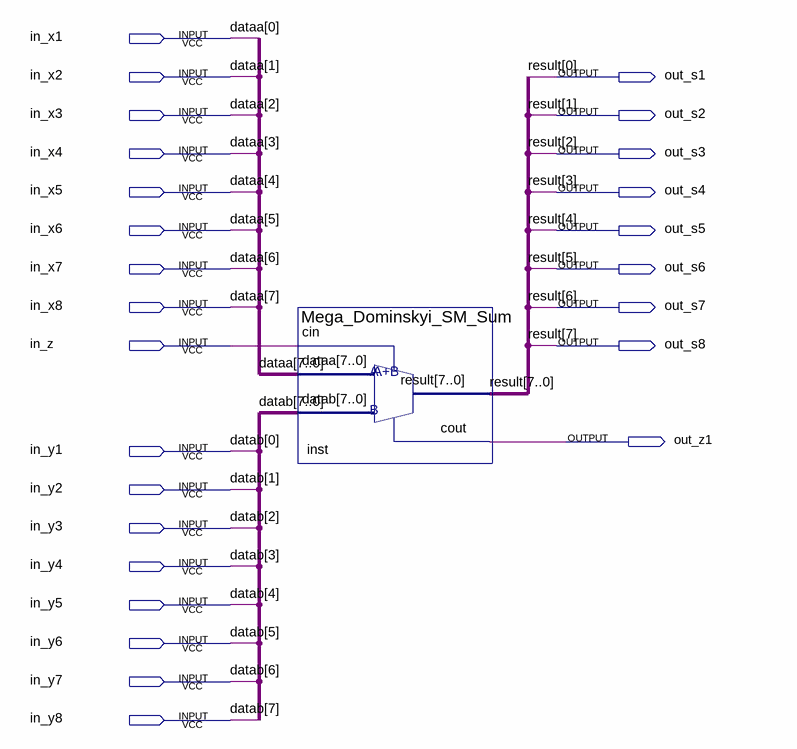
[diagram p0: schematic sheet]
// Quartus schematic Mega_Dominskyi_SM.bdf as structural Verilog: 1 symbols, 26 pins
module Mega_Dominskyi_SM (
  input  in_x1,
  input  in_x2,
  input  in_x3,
  input  in_x4,
  input  in_x5,
  input  in_x6,
  input  in_x7,
  input  in_x8,
  input  in_z,
  input  in_y1,
  input  in_y2,
  input  in_y3,
  input  in_y4,
  input  in_y5,
  input  in_y6,
  input  in_y7,
  input  in_y8,
  output out_s1,
  output out_s2,
  output out_s3,
  output out_s4,
  output out_s5,
  output out_s6,
  output out_s7,
  output out_s8,
  output out_z1
);

  Mega_Dominskyi_SM_Sum inst (
    .cin(in_z), .dataa({in_x8, in_x7, in_x6, in_x5, in_x4, in_x3, in_x2, in_x1}),
    .datab({in_y8, in_y7, in_y6, in_y5, in_y4, in_y3, in_y2, in_y1}),
    .result({out_s8, out_s7, out_s6, out_s5, out_s4, out_s3, out_s2, out_s1}), .cout(out_z1));

  // Other names for the same wires on the sheet: dataa[7:0] = {in_x8, in_x7, in_x6, in_x5, in_x4, in_x3, in_x2, in_x1};
  //   datab[7:0] = {in_y8, in_y7, in_y6, in_y5, in_y4, in_y3, in_y2, in_y1};
  //   result[7:0] = {out_s8, out_s7, out_s6, out_s5, out_s4, out_s3, out_s2, out_s1}
endmodule
